# EAGLE schematic vram_board (EAGLE 7.2.0)
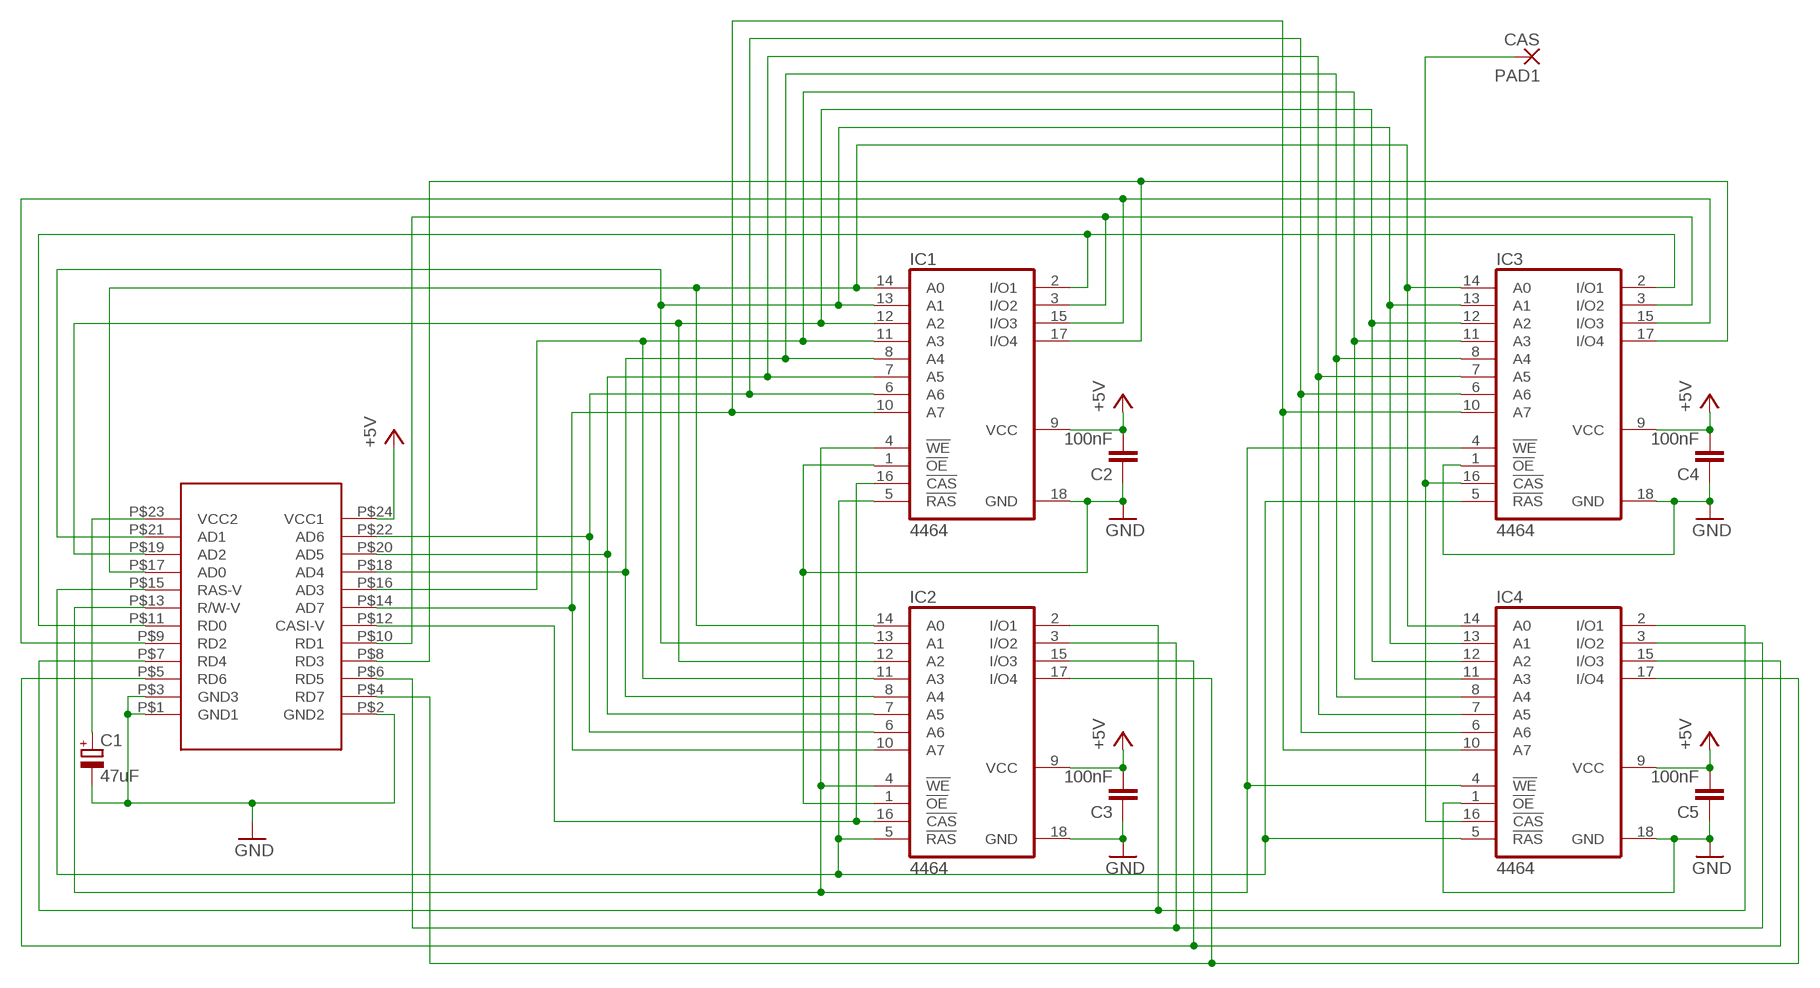
[diagram p0: schematic, sheet 1]

## Parts
C1  47uF  CPOL-EUE2-5  [E2-5]
C2  100nF  C-EU050-025X075  [C050-025X075]
C3  100nF  C-EU050-025X075  [C050-025X075]
C4  100nF  C-EU050-025X075  [C050-025X075]
C5  100nF  C-EU050-025X075  [C050-025X075]
IC1  4464  41464C  [DIL18]
IC2  4464  41464C  [DIL18]
IC3  4464  41464C  [DIL18]
IC4  4464  41464C  [DIL18]
PAD1  CAS  1,6/0,9  [1,6/0,9]
U$1  CN24DR  [VRAM_CONN]

## Nets
GND: C1.- C2.1 C3.1 C4.1 C5.1 IC1.1(!OE) IC1.18(GND) IC2.1(!OE) IC2.18(GND) IC3.1(!OE) IC3.18(GND) IC4.1(!OE) IC4.18(GND) U$1.P$1(GND1) U$1.P$2(GND2) U$1.P$3(GND3)
N$1: IC1.14(A0) IC2.14(A0) IC3.14(A0) IC4.14(A0) U$1.P$17(AD0)
N$2: IC1.12(A2) IC2.12(A2) IC3.12(A2) IC4.12(A2) U$1.P$19(AD2)
N$3: IC1.13(A1) IC2.13(A1) IC3.13(A1) IC4.13(A1) U$1.P$21(AD1)
N$4: IC1.11(A3) IC2.11(A3) IC3.11(A3) IC4.11(A3) U$1.P$16(AD3)
N$5: IC1.8(A4) IC2.8(A4) IC3.8(A4) IC4.8(A4) U$1.P$18(AD4)
N$6: IC1.7(A5) IC2.7(A5) IC3.7(A5) IC4.7(A5) U$1.P$20(AD5)
N$7: IC1.6(A6) IC2.6(A6) IC3.6(A6) IC4.6(A6) U$1.P$22(AD6)
N$8: IC1.10(A7) IC2.10(A7) IC3.10(A7) IC4.10(A7) U$1.P$14(AD7)
N$9: IC1.16(!CAS) IC2.16(!CAS) U$1.P$12(CASI-V)
N$10: IC1.5(!RAS) IC2.5(!RAS) IC3.5(!RAS) IC4.5(!RAS) U$1.P$15(RAS-V)
N$11: IC1.2(I/O1) IC3.2(I/O1) U$1.P$11(RD0)
N$12: IC1.4(!WE) IC2.4(!WE) IC3.4(!WE) IC4.4(!WE) U$1.P$13(R/W-V)
N$13: IC1.3(I/O2) IC3.3(I/O2) U$1.P$10(RD1)
N$14: IC1.15(I/O3) IC3.15(I/O3) U$1.P$9(RD2)
N$15: IC1.17(I/O4) IC3.17(I/O4) U$1.P$8(RD3)
N$16: IC2.2(I/O1) IC4.2(I/O1) U$1.P$7(RD4)
N$17: IC2.3(I/O2) IC4.3(I/O2) U$1.P$6(RD5)
N$18: IC2.15(I/O3) IC4.15(I/O3) U$1.P$5(RD6)
N$19: IC2.17(I/O4) IC4.17(I/O4) U$1.P$4(RD7)
N$20: IC3.16(!CAS) IC4.16(!CAS) PAD1.1(P)
VCC: C2.2 C3.2 C4.2 C5.2 IC1.9(VCC) IC2.9(VCC) IC3.9(VCC) IC4.9(VCC) U$1.P$24(VCC1) ; supply symbol labelled +5V
VCC1: C1.+ U$1.P$23(VCC2)

## Library data of the parts
C1 = rcl:CPOL-EU: POLARIZED CAPACITOR, European symbol
C2-C5 = rcl:C-EU: CAPACITOR, European symbol
IC1-IC4 = memory-nec:41464C: MEMORY; OC_FARNELL: unknown; OC_NEWARK: unknown
PAD1 = wirepad:1,6/0,9: THROUGH-HOLE PAD
U$1 = cx5m2_vram_board:CN24DR

## Net classes
0 default: clearance 0.205 mm